# Altium project fnc4.PrjPcb
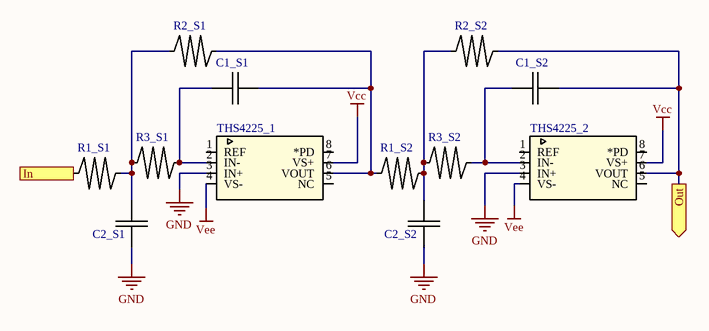
[diagram p0: Sheet1.SchDoc]
1 sheet, 12 parts. Net scope: flat (ports and power ports of the same name join across sheets).
Board file: PCB1.PcbDoc

## Sheet Sheet1.SchDoc
size A4

### Parts
C1_S1  0603  [0603]  (value not drawn)
C1_S2  0603  [0603]  (value not drawn)
C2_S1  1885  [1885]  (value not drawn)
C2_S2  1885  [1885]  (value not drawn)
R1_S1  1206  [1206]  (value not drawn)
R1_S2  1206  [1206]  (value not drawn)
R2_S1  0402  [0402]  (value not drawn)
R2_S2  0402  [0402]  (value not drawn)
R3_S1  1206  [1206]  (value not drawn)
R3_S2  1206  [1206]  (value not drawn)
THS4225_1  THS4225DGK  [DGK8-M]  (value not drawn)
THS4225_2  THS4225DGK  [DGK8-M]  (value not drawn)

### Ports
In (in), Out (out)

### Nets
GND: C2_S1.2 C2_S2.2 THS4225_1.3(IN+) THS4225_2.3(IN+)
Vcc: THS4225_1.7(VS+) THS4225_2.7(VS+)
Vee: THS4225_1.4(VS-) THS4225_2.4(VS-)
NetC1_S1_1: C1_S1.1 R1_S2.1 R2_S1.2 THS4225_1.6(VOUT)
NetC1_S1_2: C1_S1.2 R3_S1.2 THS4225_1.2(IN-)
NetC1_S2_1: C1_S2.1 R2_S2.2 THS4225_2.6(VOUT) ; port Out
NetC1_S2_2: C1_S2.2 R3_S2.2 THS4225_2.2(IN-)
NetC2_S1_1: C2_S1.1 R1_S1.2 R2_S1.1 R3_S1.1
NetC2_S2_1: C2_S2.1 R1_S2.2 R2_S2.1 R3_S2.1
NetR1_S1_1: R1_S1.1 ; port In

Not connected (* = marked no-connect by the designer): THS4225_1 1(REF) 5(NC) 8(*PD); THS4225_2 1(REF) 5(NC) 8(*PD)

### Library data of the parts
THS4225_1 THS4225_2 = 4225: Mfr_Name: Texas Instruments; Copyright: Copyright (C) 2021 Ultra Librarian. All rights reserved.; Manufacturer_Part_Number: THS4225DGK; RefDes: RefDes; Type: DEV